# EAGLE schematic 4ACto3.3DC (version 0) (EAGLE 9.6.2)
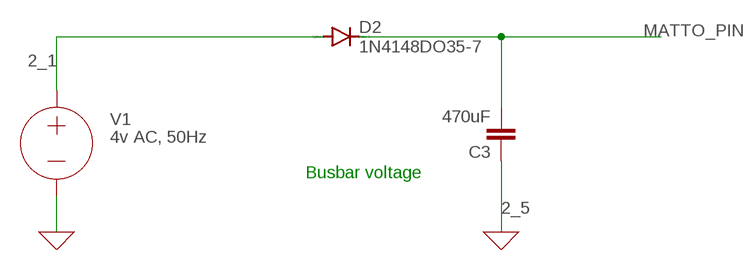
[diagram p0: schematic, sheet 1]

## Parts
C3  470uF  C2,5-3  [C2.5-3]
D2  1N4148DO35-7  [DO35-7]
V1  4v AC, 50Hz  VOLTAGE  (no package)

## Nets
0: V1.- ; supply symbol labelled GND
2_1: D2.A V1.+
2_5: C3.1 ; supply symbol labelled GND
MATTO_PIN: C3.2 D2.C

## Notes on the sheet
- Busbar voltage

## Library data of the parts
C3 = capacitor-wima:C: CAPACITOR naming: grid - package width
D2 = diode:1N4148: DIODE high speed (Philips)
V1 = ngspice-simulation:VOLTAGE: Independent Voltage Source, either DC, AC, PULSE, SINE, PWL, EXP, or SFFM; VALUE: 0V